# Altium schematic sheet Block Diagram.SchDoc
size 393 x 281 mm; SheetNumber: 1; SheetTotal: 3
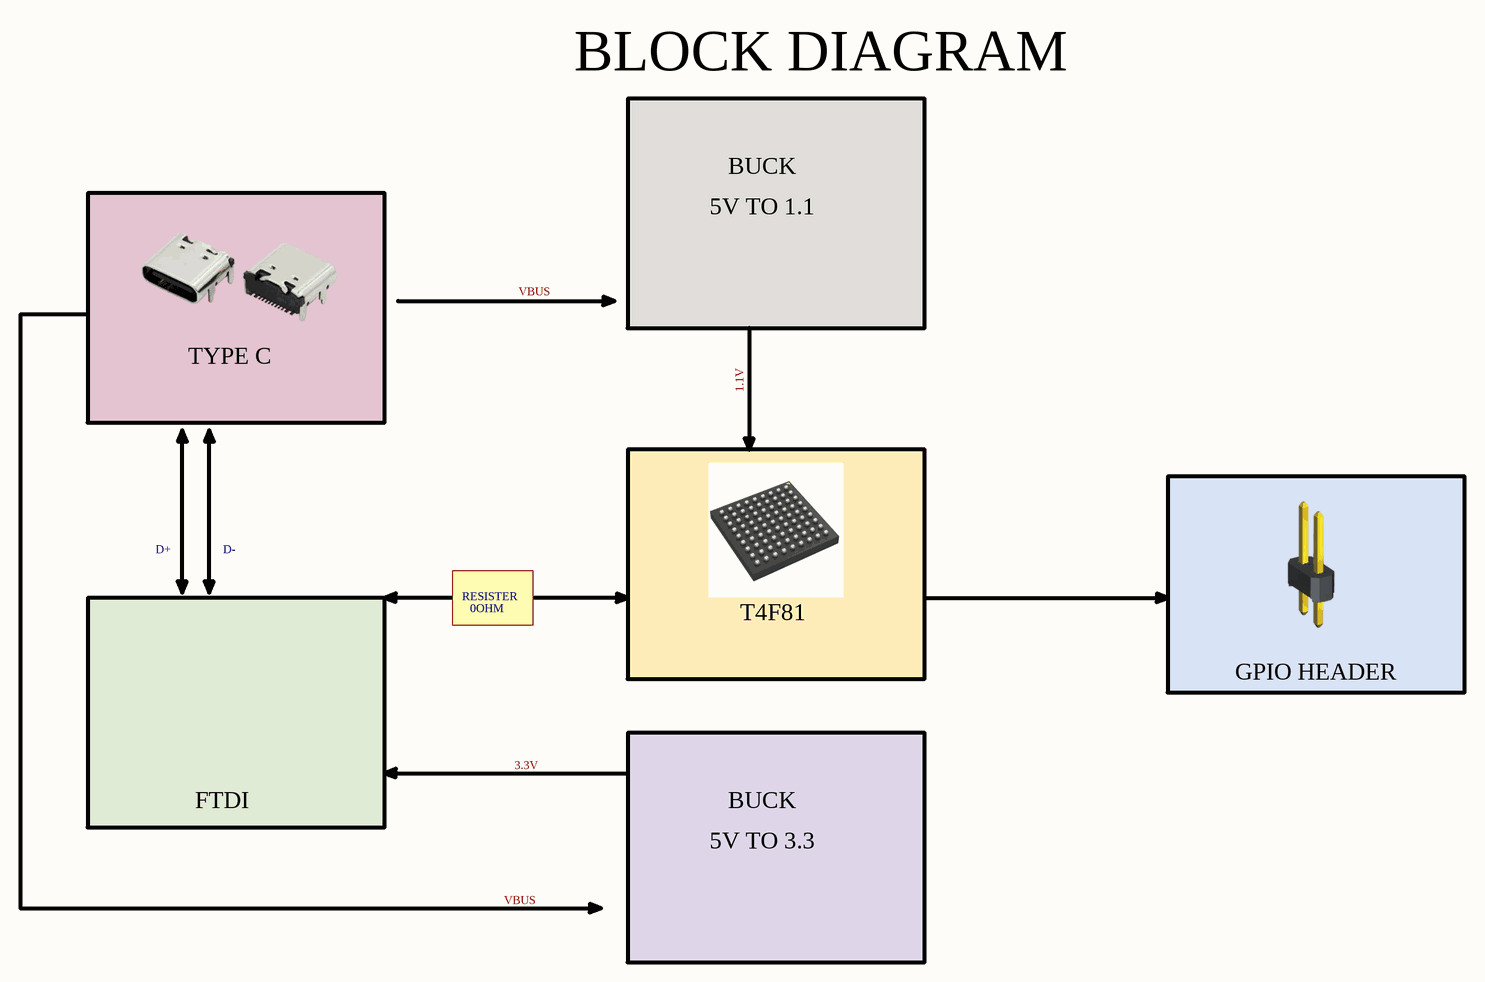
[diagram p0: Block Diagram.SchDoc]

## Notes on the sheet
- BLOCK DIAGRAM
- BUCK
- 5V TO 1.1
- VBUS
- TYPE C
- 1.1V
- D+
- D-
- RESISTER
- 0OHM
- T4F81
- GPIO HEADER
- 3.3V
- FTDI
- 5V TO 3.3
- TITLE :-
- VERSION :-
- PROJECT :-
- SHEET :-
- REVISION:-
- OF
- CONFIDENTIAL
- DATE :-